# Altium schematic sheet Detector.SchDoc
size A4; PageSetup: Record=PageOptions|CenterHorizontal=True|CenterVertical=True|PrintScale=1.00|XCorrection=1.00|YCorrection=1.00|PrintKind=1|BorderSize=5000000|LeftOffset=0|BottomOffset=0|Orientation=2|PaperLength=1000|PaperWidth=1000|Scale=100|PaperSource=7|PrintQuality=300|MediaType=1|DitherType=10|PaperKind=A4|PrintScaleMode=1
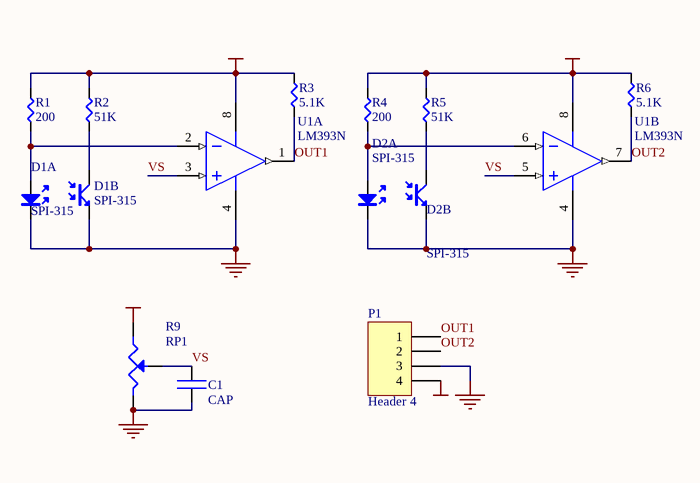
[diagram p0: Detector.SchDoc]

## Parts
C1  CAP  [C0.1/0.2]
D1  SPI-315  [photodevice]  (parts A,B of 2)
D2  SPI-315  [photodevice]  (parts A,B of 2)
P1  Header 4  [HDR1X4]
R1  200  [AXIAL0.4]
R2  51K  [AXIAL0.4]
R3  5.1K  [AXIAL0.4]
R4  200  [AXIAL0.4]
R5  51K  [AXIAL0.4]
R6  5.1K  [AXIAL0.4]
R9  RP1  [RP_05]
U1  LM393N  [626-05]  (parts A,B of 2)

## Nets
GND: C1.2 D1.2 D1.4 D2.2 D2.4 P1.3 R9.1 U1.4(GND)
VCC: P1.4 R1.2 R2.2 R3.2 R4.2 R5.2 R6.2 R9.3 U1.8(V+)
OUT1: P1.1 R3.1 U1.1(OUT)
OUT2: P1.2 R6.1 U1.7(OUT)
VS: C1.1 R9.2(W) U1.3(IN+) U1.5(IN+)
NetD1_1: D1.1 R1.1 U1.2(IN-)
NetD1_3: D1.3 R2.1
NetD2_1: D2.1 R4.1 U1.6(IN-)
NetD2_3: D2.3 R5.1

## Library data of the parts
D1 D2 = PHOTOISO3
P1 = Header 4: Header, 4-Pin; LatestRevisionDate: 17-Jul-2002; LatestRevisionNote: Re-released for DXP Platform.; Publisher: Altium Limited
R1-R6 = R1
R9 = RP1: Potentiometer
U1 = LM393N: Dual Comparator; Published: 17-Jul-2002; LatestRevisionDate: 6-Jun-2005; LatestRevisionNote: Stylized 3D Model Added.; DatasheetDocument: 1988; PackageReference: 626-05; Publisher: Altium Limited; ComponentLink1Description: Manufacturer Link; ComponentLink1URL: http://www.motorola.com/